# EAGLE design MRCS-PCR-Clinic (EAGLE 7.7.0)
PCR Clinic board
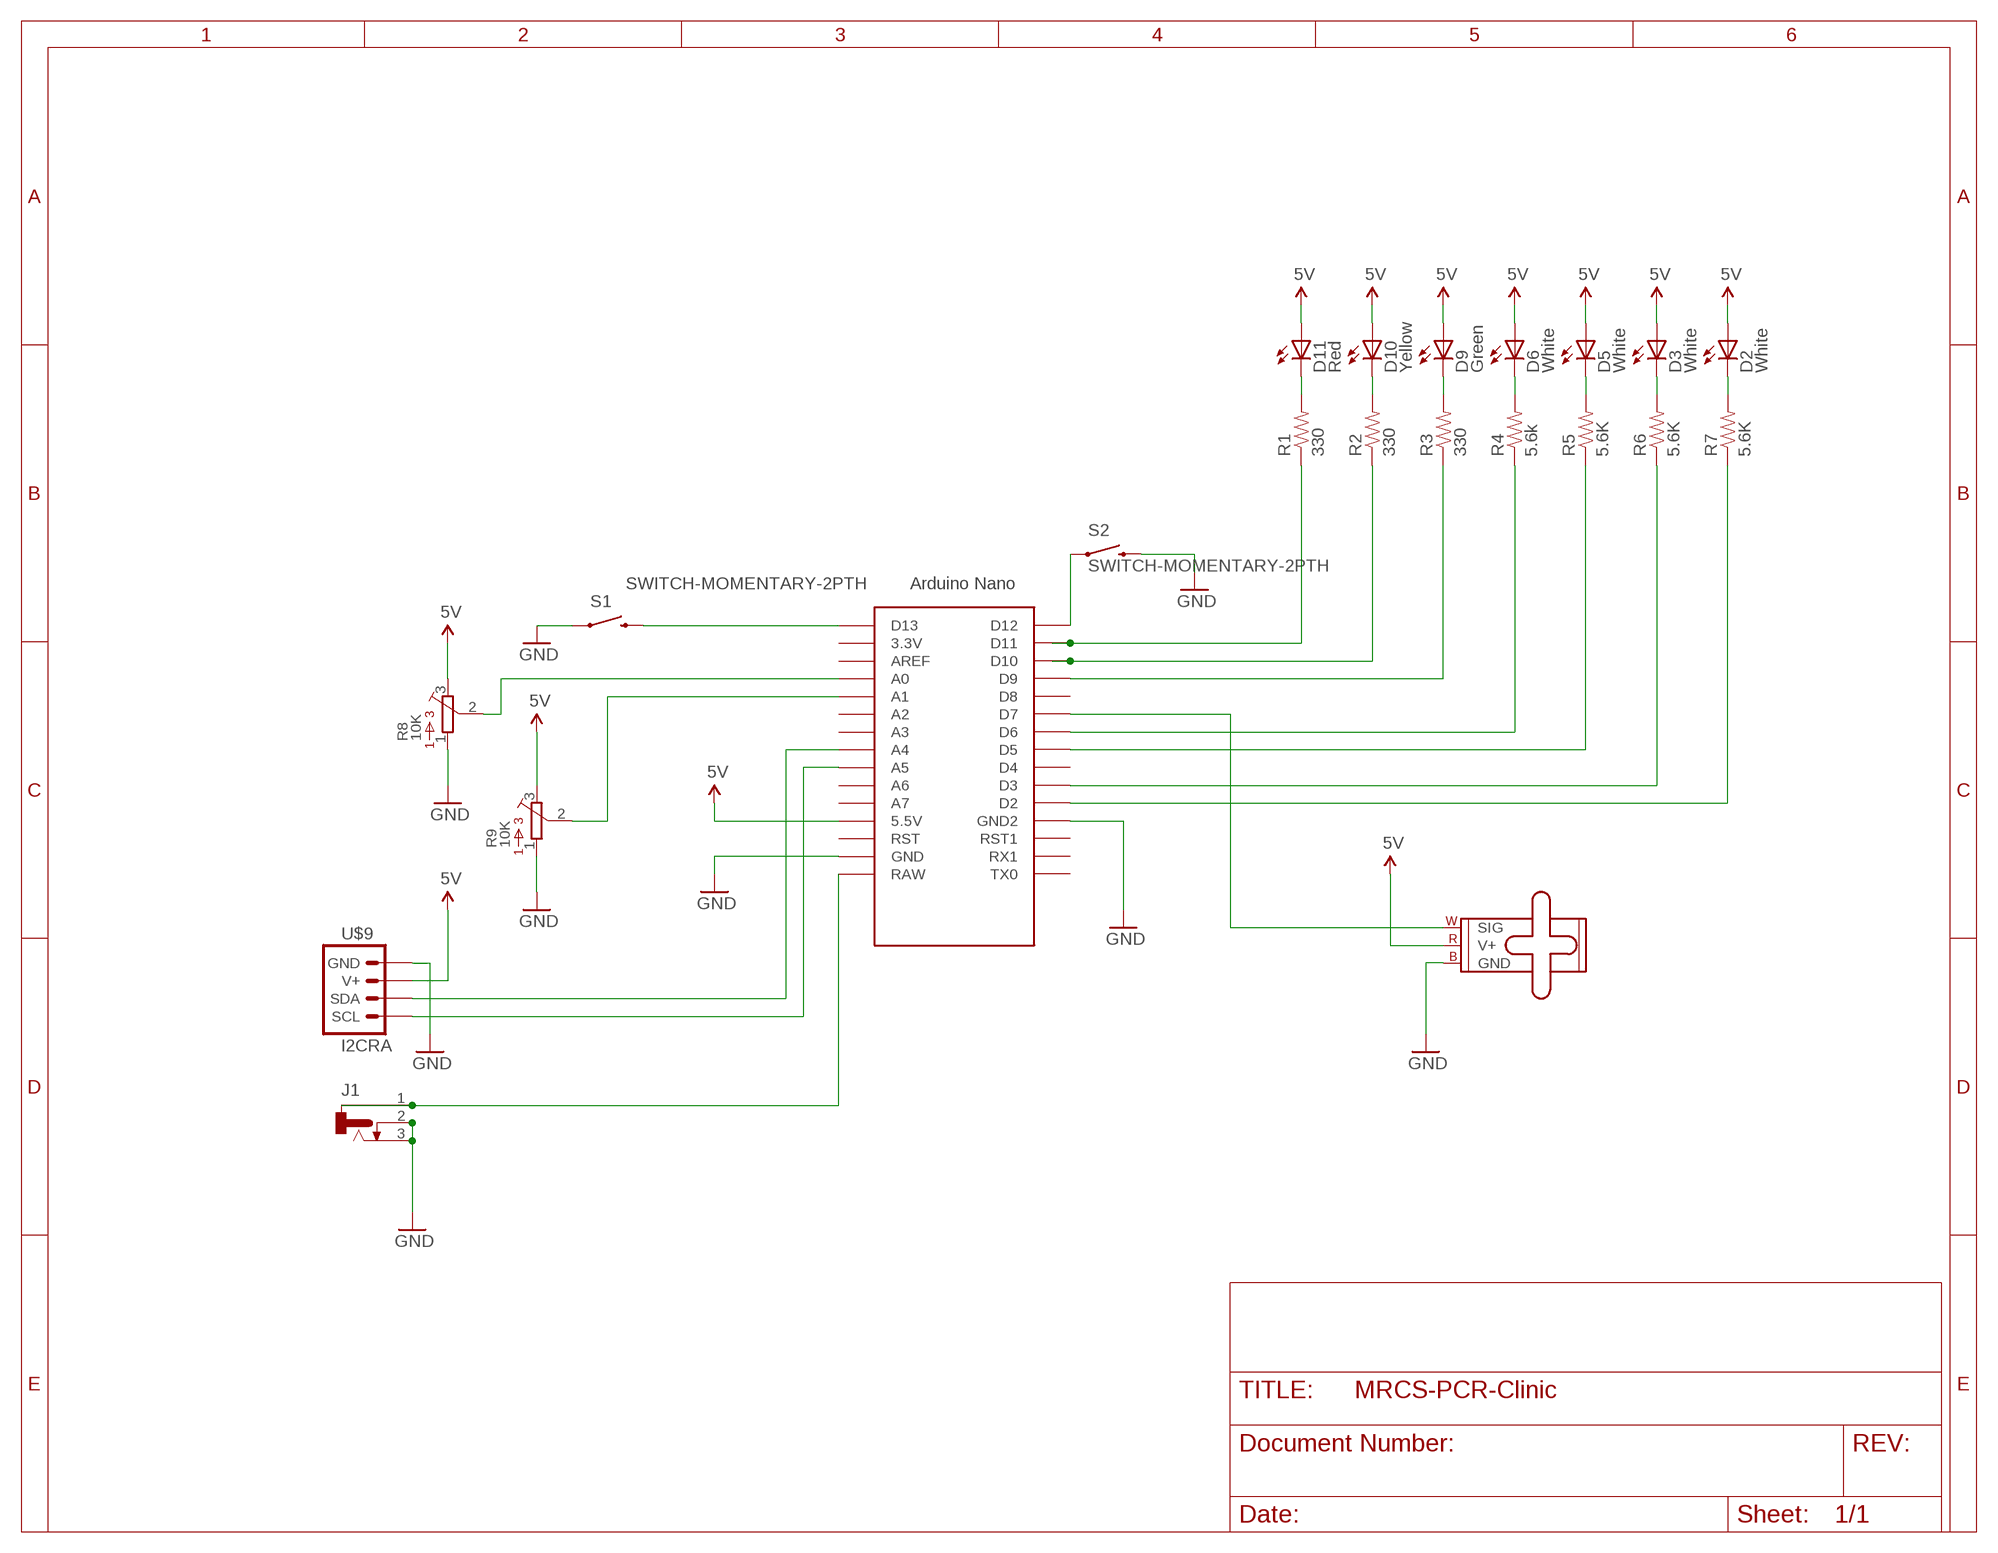
[diagram p0: schematic, sheet 1]

## Parts
D2  White  LEDLED3MM  [LED3MM]
D3  White  LEDLED3MM  [LED3MM]
D5  White  LEDLED3MM  [LED3MM]
D6  White  LEDLED3MM  [LED3MM]
D9  Green  LEDLED3MM  [LED3MM]
D10  Yellow  LEDLED3MM  [LED3MM]
D11  Red  LEDLED3MM  [LED3MM]
J1  CONNECTOR-DC-POWER-RA  [DCJ0202]
M2  SMALL_SERVO  [1X03]
R1  330  RESISTORPTH-1/4W  [AXIAL-0.4]
R2  330  RESISTORPTH-1/4W  [AXIAL-0.4]
R3  330  RESISTORPTH-1/4W  [AXIAL-0.4]
R4  5.6k  RESISTORPTH-1/4W  [AXIAL-0.4]
R5  5.6K  RESISTORPTH-1/4W  [AXIAL-0.4]
R6  5.6K  RESISTORPTH-1/4W  [AXIAL-0.4]
R7  5.6K  RESISTORPTH-1/4W  [AXIAL-0.4]
R8  10K  3386-P  [3386P]
R9  10K  3386-P  [3386P]
S1  SWITCH-MOMENTARY-2PTH  [TACTILE-PTH]
S2  SWITCH-MOMENTARY-2PTH  [TACTILE-PTH]
U$1  NANO  [NANO]
U$9  I2CRA  [I2C]

## Nets
5V [Power]: D2.A D3.A D5.A D6.A D9.A D10.A D11.A M2.2(V+) R8.3 R9.3 U$1.5V(5.5V) U$9.V+
A0: R8.2 U$1.A0
A1: R9.2 U$1.A1
D2: R7.P$1 U$1.D2
D3: R6.P$1 U$1.D3
D5: R5.P$1 U$1.D5
D6: R4.P$1 U$1.D6
D7: M2.1(SIG) U$1.D7
D9: R3.P$1 U$1.D9
D10: R2.P$1 U$1.D10
D11: R1.P$1 U$1.D11
D12: S2.1 U$1.D12
D13: S1.3 U$1.D13
GND [Power]: J1.2 J1.3 M2.3(GND) R8.1 R9.1 S1.1 S2.3 U$1.GND U$1.GND1(GND2) U$9.GND
N$1: J1.1 U$1.RAW
N$2: D11.K(C) R1.P$2
N$3: D10.K(C) R2.P$2
N$4: D9.K(C) R3.P$2
N$5: D6.K(C) R4.P$2
N$6: D5.K(C) R5.P$2
N$7: D3.K(C) R6.P$2
N$8: D2.K(C) R7.P$2
SCL: U$1.A5 U$9.SCL
SDA: U$1.A4 U$9.SDA
Unconnected: U$1.3.3V U$1.A2 U$1.A3 U$1.A6 U$1.A7 U$1.AREF U$1.D4 U$1.D8 U$1.RST U$1.RST1 U$1.RX1 U$1.TX0

## Library data of the parts
D2 D3 D5 D6 D9-D11 = SPCoast:LED*
J1 = SPCoast:CONNECTOR-DC-POWER: DC POWER JACK Source: DCJ0202.pdf
M2 = SparkFun-Electromechanical:SMALL_SERVO: Small servo motor This is the small servo used in the SIK. SKU: ROB-09065
R1-R7 = SparkFun-Resistors:RESISTOR: Resistor Basic schematic elements and footprints for 0603, 1206, and PTH resistors.
R8 R9 = bourns_test:3386-: 3386 Series 3/8" Square Trimmer
S1 S2 = SparkFun-Electromechanical:SWITCH-MOMENTARY-2: Various NO switches- pushbuttons, reed, etc
U$1 = Arduino-clone-scn:NANO: Arduino Nano
U$9 = SPCoast-minimal:I2C

## Net classes
0 default: width 0.305 mm
1 Power: width 0.61 mm

## Board
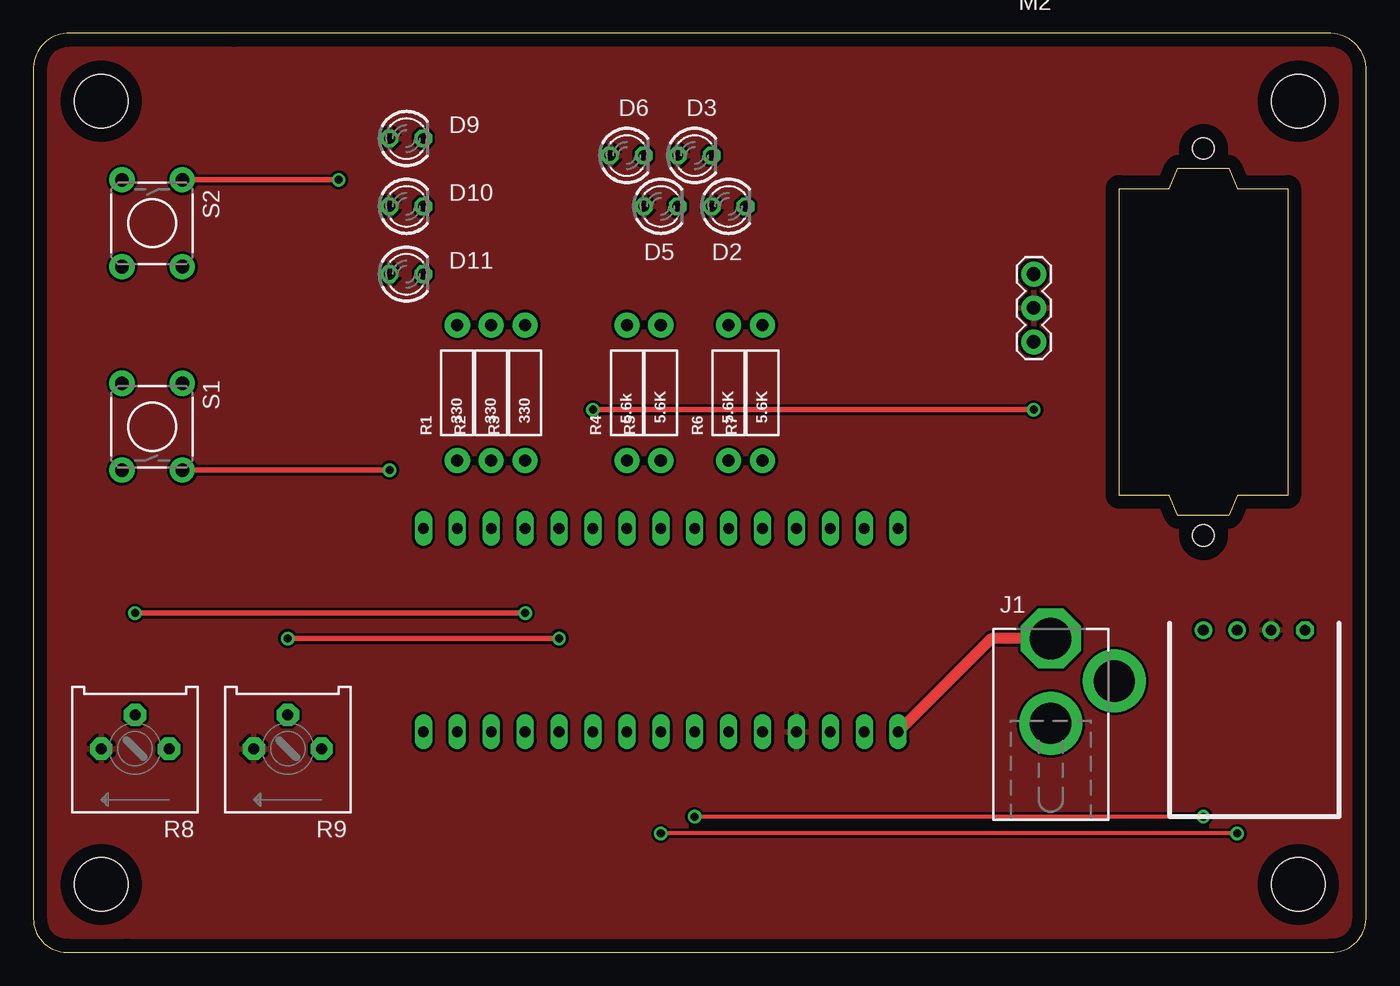
[diagram p1: board, top side]
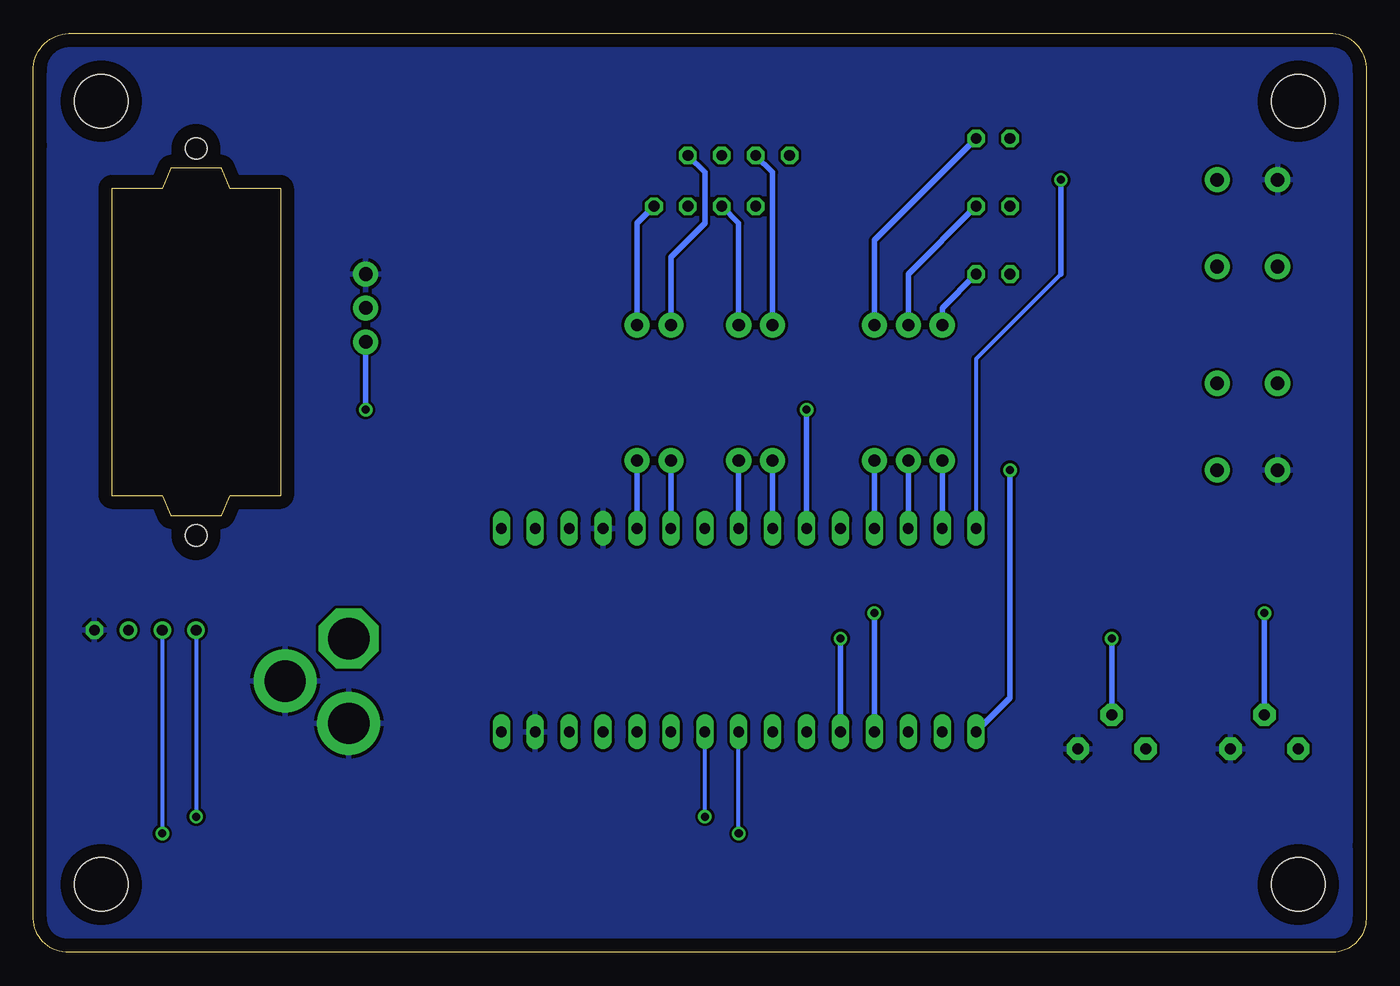
[diagram p2: board, bottom side, seen from below]

Size 99.82 x 68.83 mm. Coordinates in mm from the lower left corner, seen from the top.
Copper layers (1*16): Top 0.035mm / dielectric 1.5mm / Bottom 0.035mm
Design rules "default": minimum track width 10mil, minimum drill 24mil, track to track 8mil, track to pad 8mil, pad to pad 8mil, via to via 8mil, smd to smd 8mil, copper to edge 40mil, drill to drill 8mil, minimum pad ring 10mil, minimum via ring 8mil, stop-mask expansion 4mil, vias tented up to drill 0mil, thermal gap 10mil

### Footprints (pad centres in the part's own frame; a part is rotated, then mirrored left to right if it is on the bottom)
LED3MM = drill 0.813 octagon: A -1.27,0; K 1.27,0
DCJ0202 = drill 3.1 pad 4.5 octagon: 1 0,3.175 | drill 3.1 pad 4.7: 2 4.763,0; 3 0,-3.175
1X03 = drill 1.016 pad 1.88: 1 0,0; 2 2.54,0; 3 5.08,0
AXIAL-0.4 = drill 0.9 pad 1.88: P$1 -5.08,0; P$2 5.08,0
3386P = drill 0.813 pad 1.676 octagon: 1 -2.54,0; 2 0,-2.54; 3 2.54,0
TACTILE-PTH = drill 1.016 pad 1.88: 1 -3.251,2.261; 2 3.251,2.261; 3 -3.251,-2.261; 4 3.251,-2.261
NANO = drill 0.8 long: 3.3V -10.16,24.13; 5V -10.16,-1.27; A0 -10.16,19.05; A1 -10.16,16.51; A2 -10.16,13.97; A3 -10.16,11.43; A4 -10.16,8.89; A5 -10.16,6.35; A6 -10.16,3.81; A7 -10.16,1.27; AREF -10.16,21.59; D2 5.08,1.27; D3 5.08,3.81; D4 5.08,6.35; D5 5.08,8.89; D6 5.08,11.43; D7 5.08,13.97; D8 5.08,16.51; D9 5.08,19.05; D10 5.08,21.59; D11 5.08,24.13; D12 5.08,26.67; D13 -10.16,26.67; GND -10.16,-6.35; GND1 5.08,-1.27; RAW -10.16,-8.89; RST -10.16,-3.81; RST1 5.08,-3.81; RX1 5.08,-6.35; TX0 5.08,-8.89
I2C = drill 0.8 octagon: GND 3.81,0 | drill 0.8: SCL -3.81,0; SDA -1.27,0; V+ 1.27,0
BOARD-DINRAIL-2.7IN = hole 4: 94.742,5.08; 5.08,63.754; 94.742,63.754; 5.08,5.08
SERVO-9G = hole 1.6: -14.5,0; 14.5,0

### Placement (x,y rotation side)
D2  52.07,55.88 0 top
D3  49.53,59.69 0 top
D5  46.99,55.88 0 top
D6  44.45,59.69 0 top
D9  27.94,60.96 0 top
D10  27.94,55.88 0 top
D11  27.94,50.8 0 top
J1  76.2,20.32 0 top
M2  74.93,45.72 90 top
R1  31.75,41.91 90 top
R2  34.29,41.91 90 top
R3  36.83,41.91 90 top
R4  44.45,41.91 90 top
R5  46.99,41.91 90 top
R6  52.07,41.91 90 top
R7  54.61,41.91 90 top
R8  7.62,15.24 180 top
R9  19.05,15.24 180 top
S1  8.89,39.37 90 top
S2  8.89,54.61 270 top
U$1  55.88,26.67 90 top
U$9  91.44,24.13 0 top
U$10  [BOARD-DINRAIL-2.7IN]  0,0 0 top
U$11  [SERVO-9G]  87.63,45.72 90 top

### Tracks (layer width: path | path; a pad name or v marks a point on that pad's centre or on a via)
5V
  pour Top: 0,68.58 100.33,68.58 100.33,0 0,0
A0  (via drill 0.6)
  Top 0.406: v7.62,25.4 v36.83,25.4
  Bottom 0.406: R8.2 v7.62,25.4 | v36.83,25.4 U$1.A0
A1  (via drill 0.6)
  Top 0.406: v19.05,23.5 v39.37,23.5
  Bottom 0.406: R9.2 v19.05,23.5 | v39.37,23.5 U$1.A1
D2
  Bottom 0.406: U$1.D2 R7.P$1
D3
  Bottom 0.406: R6.P$1 U$1.D3
D5
  Bottom 0.406: R5.P$1 U$1.D5
D6
  Bottom 0.406: R4.P$1 U$1.D6
D7  (via drill 0.6)
  Top 0.406: v41.91,40.64 v74.93,40.64
  Bottom 0.406: U$1.D7 v41.91,40.64 | v74.93,40.64 M2.1
D9
  Bottom 0.406: R3.P$1 U$1.D9
D10
  Bottom 0.406: R2.P$1 U$1.D10
D11
  Bottom 0.406: R1.P$1 U$1.D11
D12  (via drill 0.6)
  Top 0.406: S2.1 v22.86,57.86
  Bottom 0.305: 22.86,50.8 29.21,44.45 U$1.D12
  Bottom 0.406: v22.86,57.86 22.86,50.8
D13  (via drill 0.6)
  Top 0.406: S1.3 v26.67,36.12
  Bottom 0.406: v26.67,36.12 26.67,19.05 U$1.D13
GND
  pour Bottom: 0,68.58 100.33,68.58 100.33,0 0,0
N$1
  Top 0.813: J1.1 71.76,23.5 U$1.RAW
N$2
  Bottom 0.406: R1.P$2 31.75,48.26 D11.K
N$3
  Bottom 0.406: R2.P$2 34.29,50.8 D10.K
N$4
  Bottom 0.406: R3.P$2 36.83,53.34 D9.K
N$5
  Bottom 0.406: R4.P$2 44.45,58.42 D6.K
N$6
  Bottom 0.406: R5.P$2 46.99,54.61 D5.K
N$7
  Bottom 0.406: R6.P$2 52.07,52.07 49.53,54.61 49.53,58.42 D3.K
N$8
  Bottom 0.406: R7.P$2 54.61,54.61 D2.K
SCL  (via drill 0.6)
  Top 0.305: v87.63,10.16 v49.53,10.16
  Bottom 0.305: U$9.SCL v87.63,10.16 | v49.53,10.16 U$1.A5
SDA  (via drill 0.6)
  Top 0.305: v90.17,8.89 v46.99,8.89
  Bottom 0.305: U$9.SDA v90.17,8.89 | v46.99,8.89 U$1.A4

### Text on the board
tDocu: Earl Girbovan | Seth Neumann / John Plocher | D12 | BROWN | ORANGE | D7 | V1.0 170813c-1 | D13 | USB | A0 | A1 | Arduino Nano | PCR Arduino Clinic - 2017
bDocu: Solder Side | Model Railroading is fun!